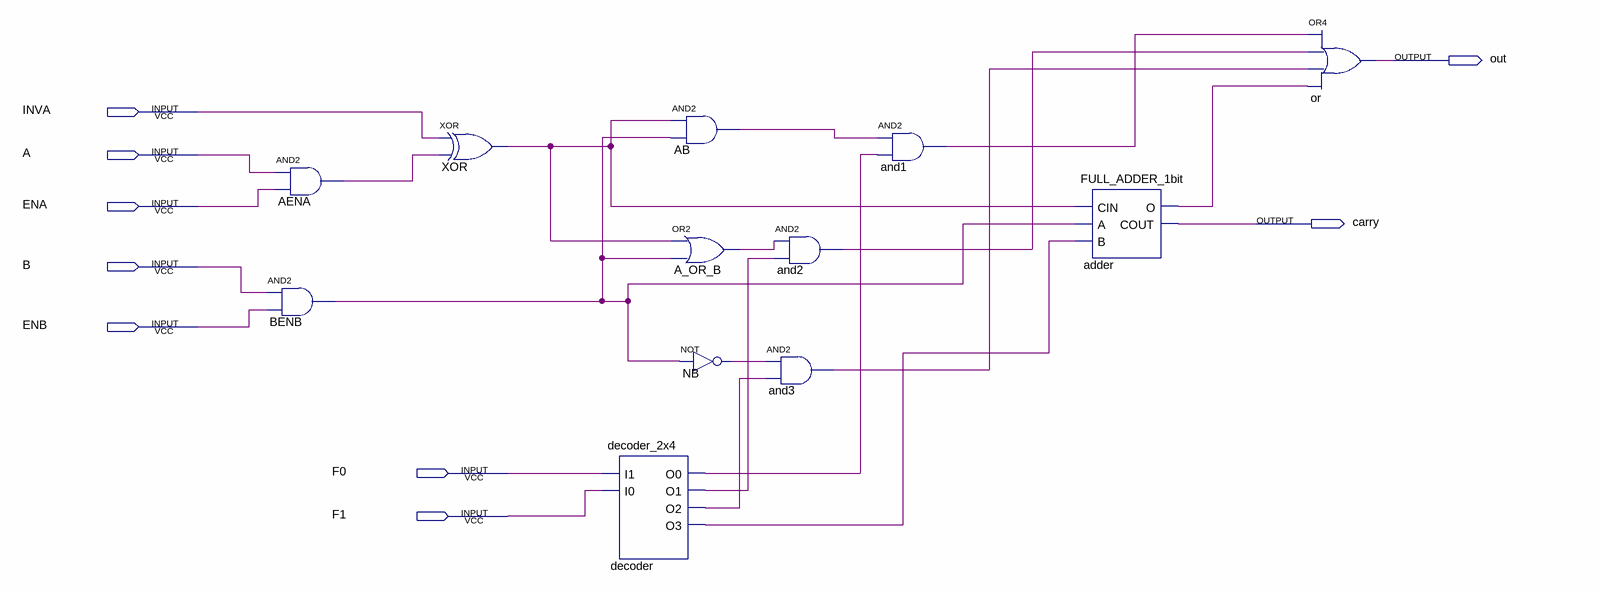
[diagram p0: schematic sheet]
// Quartus schematic ULA_1bit.bdf as structural Verilog: 12 symbols, 9 pins
module ULA_1bit (
  input  INVA,
  input  A,
  input  ENA,
  input  B,
  input  ENB,
  input  F0,
  input  F1,
  output out,
  output carry
);

  wire A_OR_B_out, AB_out, adder_o, AENA_out, and1_out, and2_out, and3_out, BENB_out, decoder_o0, decoder_o1,
       decoder_o2, decoder_o3, NB_out, XOR_out;

  and AENA (AENA_out, A, ENA);
  and BENB (BENB_out, B, ENB);
  xor XOR (XOR_out, INVA, AENA_out);
  decoder_2x4 decoder (.I1(F0), .I0(F1), .O0(decoder_o0), .O1(decoder_o1), .O2(decoder_o2), .O3(decoder_o3));
  and AB (AB_out, XOR_out, BENB_out);
  or A_OR_B (A_OR_B_out, XOR_out, BENB_out);
  not NB (NB_out, BENB_out);
  and and2 (and2_out, A_OR_B_out, decoder_o1);
  and and3 (and3_out, NB_out, decoder_o2);
  and and1 (and1_out, AB_out, decoder_o0);
  FULL_ADDER_1bit adder (.CIN(XOR_out), .A(BENB_out), .B(decoder_o3), .O(adder_o), .COUT(carry));
  or \or  (out, and1_out, and2_out, and3_out, adder_o);
endmodule
